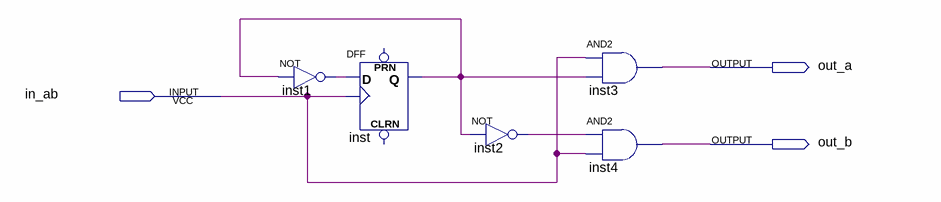
[diagram p0: schematic sheet]
// Quartus schematic sig_out_m.bdf as structural Verilog: 5 symbols, 3 pins
module sig_out_m (
  input  in_ab,
  output out_a,
  output out_b
);

  wire inst1_out, inst2_out, inst_q;

  not inst1 (inst1_out, inst_q);
  DFF inst (.CLK(in_ab), .D(inst1_out), .Q(inst_q));  // open: CLRN, PRN
  not inst2 (inst2_out, inst_q);
  and inst3 (out_a, in_ab, inst_q);
  and inst4 (out_b, inst2_out, in_ab);
endmodule
